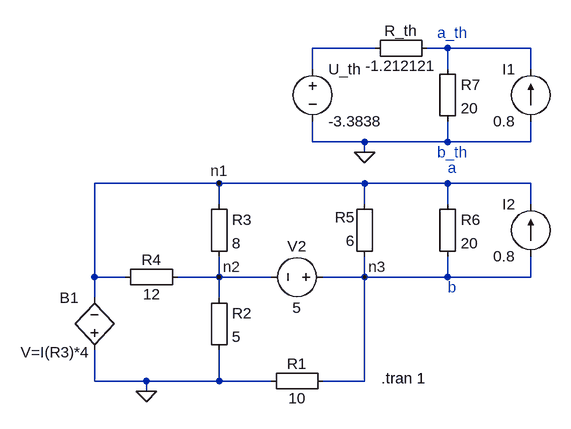
[diagram p0: schematic circuits_ass2.asc]
circuits_ass2.asc, the LTspice schematic file:
Version 4
SHEET 1 960 680
WIRE 544 -304 448 -304
WIRE 656 -304 624 -304
WIRE 784 -304 656 -304
WIRE 448 -272 448 -304
WIRE 656 -272 656 -304
WIRE 784 -272 784 -304
WIRE 448 -160 448 -192
WIRE 528 -160 448 -160
WIRE 656 -160 656 -192
WIRE 656 -160 528 -160
WIRE 784 -160 784 -192
WIRE 784 -160 656 -160
WIRE 528 -144 528 -160
WIRE 304 -96 112 -96
WIRE 528 -96 304 -96
WIRE 656 -96 528 -96
WIRE 784 -96 656 -96
WIRE 304 -64 304 -96
WIRE 528 -64 528 -96
WIRE 656 -64 656 -96
WIRE 784 -64 784 -96
WIRE 112 48 112 -96
WIRE 160 48 112 48
WIRE 304 48 304 16
WIRE 304 48 240 48
WIRE 384 48 304 48
WIRE 528 48 528 16
WIRE 528 48 464 48
WIRE 656 48 656 16
WIRE 656 48 528 48
WIRE 784 48 784 16
WIRE 784 48 656 48
WIRE 112 80 112 48
WIRE 304 80 304 48
WIRE 112 208 112 160
WIRE 192 208 112 208
WIRE 304 208 304 160
WIRE 304 208 192 208
WIRE 384 208 304 208
WIRE 528 208 528 48
WIRE 528 208 464 208
WIRE 192 224 192 208
FLAG 192 224 0
FLAG 304 -96 n1
FLAG 304 48 n2
FLAG 528 48 n3
FLAG 528 -144 0
SYMBOL voltage 480 48 R90
WINDOW 0 -32 56 VBottom 2
WINDOW 3 32 56 VTop 2
WINDOW 123 0 0 Left 0
WINDOW 39 0 0 Left 0
SYMATTR InstName V2
SYMATTR Value 5
SYMBOL Misc\\EuropeanResistor 480 192 R90
WINDOW 0 5 56 VBottom 2
WINDOW 3 27 56 VTop 2
SYMATTR InstName R1
SYMATTR Value 10
SYMBOL Misc\\EuropeanResistor 288 64 R0
SYMATTR InstName R2
SYMATTR Value 5
SYMBOL Misc\\EuropeanResistor 288 -80 R0
SYMATTR InstName R3
SYMATTR Value 8
SYMBOL Misc\\EuropeanResistor 144 64 R270
WINDOW 0 27 56 VTop 2
WINDOW 3 5 56 VBottom 2
SYMATTR InstName R4
SYMATTR Value 12
SYMBOL Misc\\EuropeanResistor 544 32 R180
WINDOW 0 31 76 Left 2
WINDOW 3 31 40 Left 2
SYMATTR InstName R5
SYMATTR Value 6
SYMBOL bv 112 176 R180
WINDOW 0 24 96 Left 2
WINDOW 3 7 12 Left 2
SYMATTR InstName B1
SYMATTR Value V=I(R3)*4
SYMBOL Misc\\EuropeanResistor 528 -288 R270
WINDOW 0 27 56 VTop 2
WINDOW 3 5 56 VBottom 2
SYMATTR InstName R_th
SYMATTR Value -1.212121
SYMBOL voltage 448 -288 R0
WINDOW 123 0 0 Left 0
WINDOW 39 0 0 Left 0
SYMATTR InstName U_th
SYMATTR Value -3.3838
SYMBOL Misc\\EuropeanResistor 640 -288 R0
SYMATTR InstName R7
SYMATTR Value 20
SYMBOL current 784 -192 R180
WINDOW 0 24 80 Left 2
WINDOW 3 24 0 Left 2
WINDOW 123 0 0 Left 0
WINDOW 39 0 0 Left 0
SYMATTR InstName I1
SYMATTR Value 0.8
SYMBOL Misc\\EuropeanResistor 640 -80 R0
SYMATTR InstName R6
SYMATTR Value 20
SYMBOL current 784 16 R180
WINDOW 0 24 80 Left 2
WINDOW 3 24 0 Left 2
WINDOW 123 0 0 Left 0
WINDOW 39 0 0 Left 0
SYMATTR InstName I2
SYMATTR Value 0.8
TEXT 554 204 Left 2 !.tran 1
TEXT 656 -120 Left 2 ;a
TEXT 656 64 Left 2 ;b
TEXT 640 -328 Left 2 ;a_th
TEXT 640 -144 Left 2 ;b_th

The netlist it stands for:
* circuits_ass2.asc
V2 n3 n2 5
R1 n3 0 10
R2 n2 0 5
R3 n1 n2 8
R4 n1 n2 12
R5 n3 n1 6
B1 0 n1 V=I(R3)*4
R_th N001 N002 -1.212121
V§U_th N001 0 -3.3838
R7 N002 0 20
I1 0 N002 0.8
R6 n1 n3 20
I2 n3 n1 0.8
.tran 1
* a
* b
* a_th
* b_th
.backanno
.end